# EAGLE design StdBx Proto Board w UNO(ALPHA) (EAGLE 6.6.0)
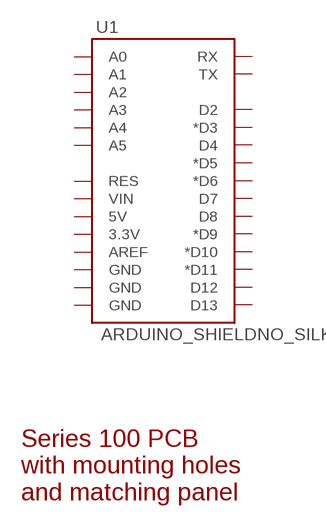
[diagram p0: schematic, sheet 1]

## Parts
U1  ARDUINO_SHIELDNO_SILK  [DUEMILANOVE_VIAS]
U$1  SERIES_100"  [SERIES_100]
Unconnected: U1.3.3V U1.5V U1.A0 U1.A1 U1.A2 U1.A3 U1.A4 U1.A5 U1.AREF U1.D2 U1.D3(*D3) U1.D4 U1.D5(*D5) U1.D6(*D6) U1.D7 U1.D8 U1.D9(*D9) U1.D10(*D10) U1.D11(*D11) U1.D12 U1.D13 U1.GND@0(GND) U1.GND@1(GND) U1.GND@2(GND) U1.RES U1.RX U1.TX U1.VIN

## Library data of the parts
U1 = SparkFun-Boards:ARDUINO_SHIELD: Arduino shield footprint
U$1 = StdBxLibrary:SERIES_100: Circuit board outline sized and with mounting that will fit the Series 100 line of StdBx enclosures. Components from the StdBx library include information that combined with this component will export a DXF file to create the end panel for the enclosure.

## Board
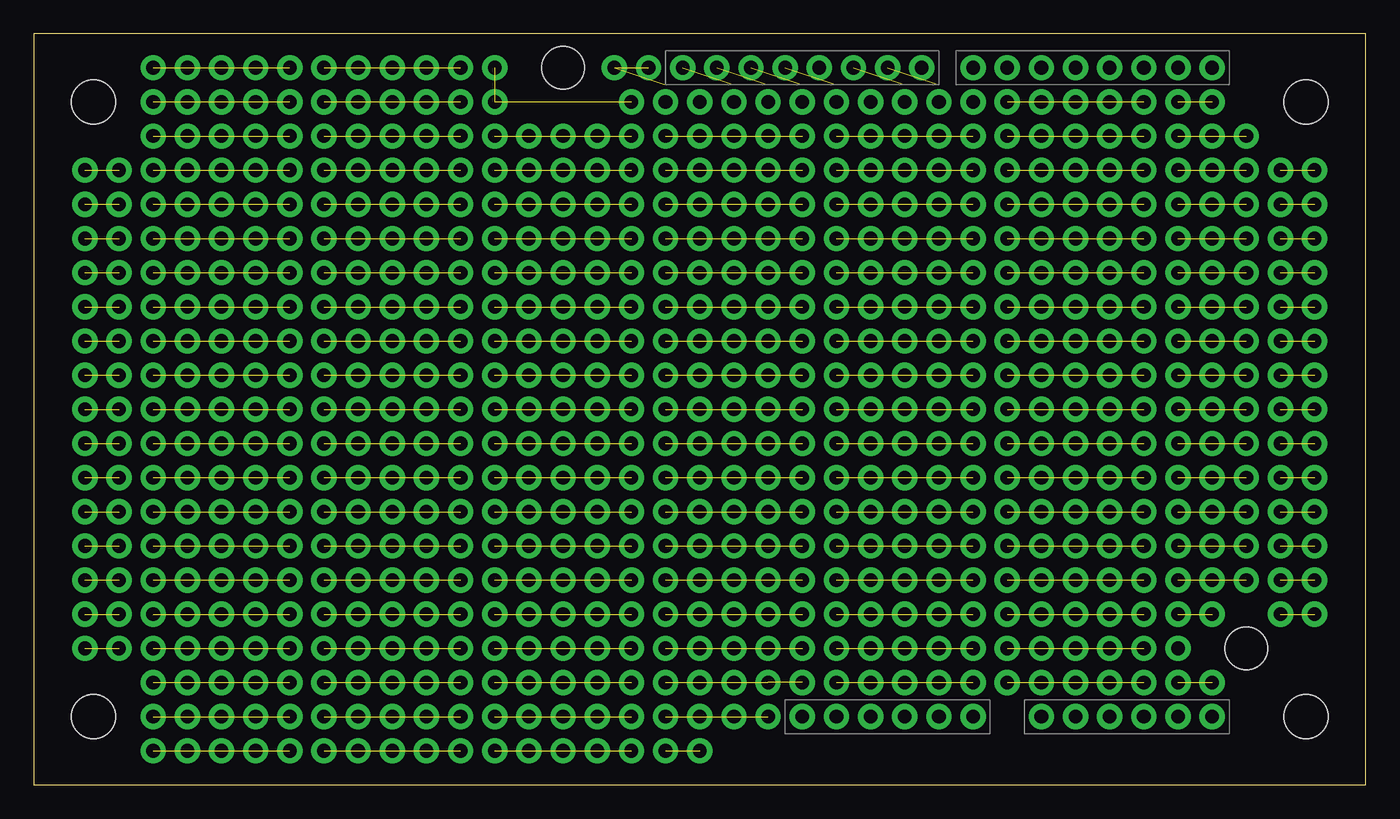
[diagram p1: board, top side]
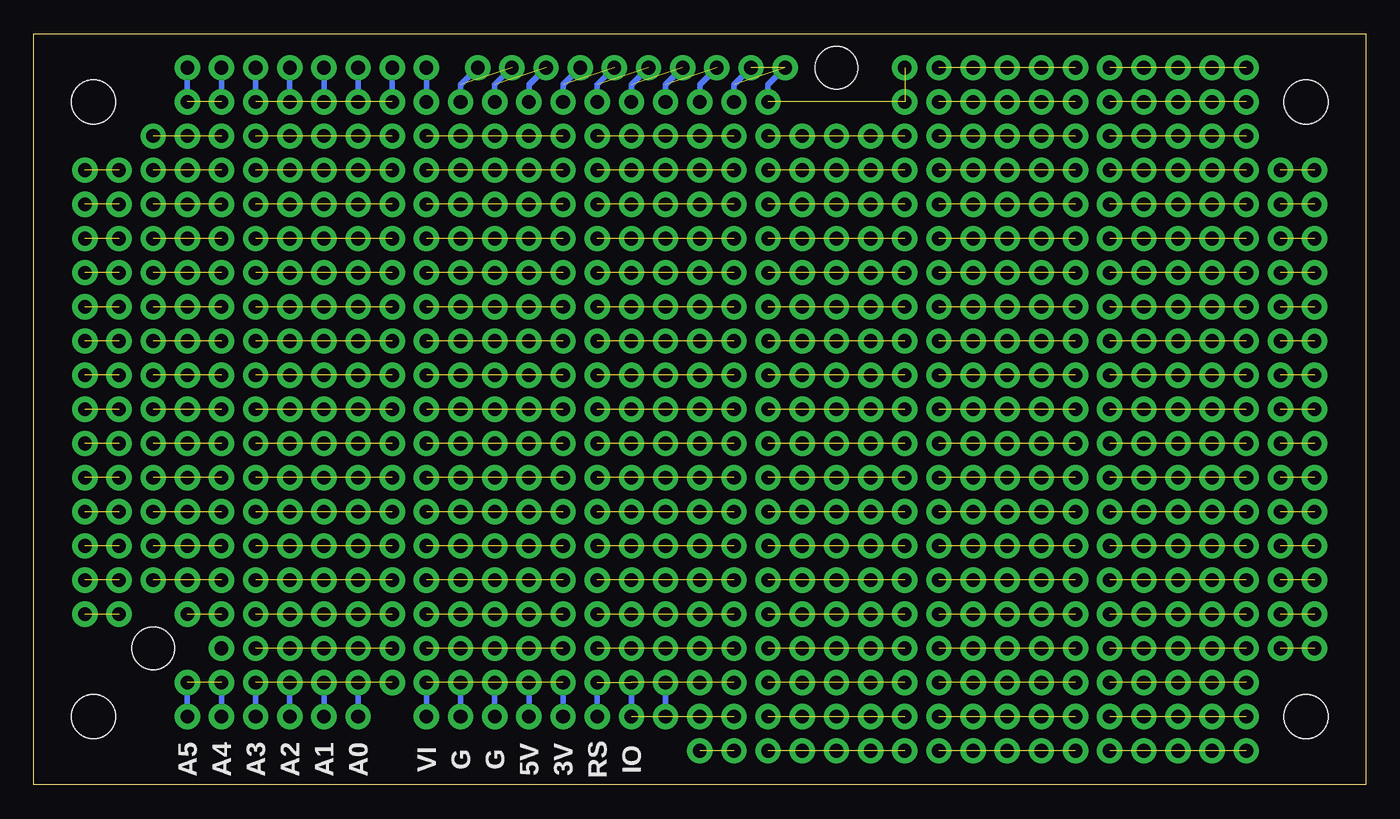
[diagram p2: board, bottom side, seen from below]

Size 99.06 x 55.88 mm. Coordinates in mm from the lower left corner, seen from the top.
Copper layers (1*16): Top 0.035mm / dielectric 1.5mm / Bottom 0.035mm
Design rules "default": minimum track width 10mil, minimum drill 24mil, track to track 8mil, track to pad 8mil, pad to pad 8mil, via to via 8mil, smd to smd 8mil, copper to edge 40mil, drill to drill 8mil, minimum pad ring 10mil, minimum via ring 8mil, stop-mask expansion 4mil, vias tented up to drill 0mil, thermal gap 10mil
Holes 3.17 mm at 39.37,53.34 90.17,10.16

### Footprints (pad centres in the part's own frame; a part is rotated, then mirrored left to right if it is on the bottom)
DUEMILANOVE_VIAS = drill 1.016 pad 1.88: 3.3V 50.8,13.97; 5V 50.8,16.51; A0 50.8,29.21; A1 50.8,31.75; A2 50.8,34.29; A3 50.8,36.83; A4 50.8,39.37; A5 50.8,41.91; AREF 2.54,2.54; D2 2.54,36.83; D3 2.54,34.29; D4 2.54,31.75; D5 2.54,29.21; D6 2.54,26.67; D7 2.54,24.13; D8 2.54,20.32; D9 2.54,17.78; D10 2.54,15.24; D11 2.54,12.7; D12 2.54,10.16; D13 2.54,7.62; GND@0 50.8,19.05; GND@1 50.8,21.59; GND@2 2.54,5.08; RES 50.8,11.43; RX 2.54,41.91; TX 2.54,39.37; VIN 50.8,24.13
SERIES_100 = hole 3.302: 4.445,50.8; 94.615,50.8; 4.445,5.08; 94.615,5.08

### Placement (x,y rotation side)
U1  45.72,55.88 270 top
U$1  0,0 0 top

### Tracks (layer width: path | path; a pad name or v marks a point on that pad's centre or on a via)
N$1  (via drill 1.02 pad 1.88)  (4 unrouted)
  other vias: 16.51,53.34 13.97,53.34 11.43,53.34 8.89,53.34 19.05,53.34
N$2  (via drill 1.02 pad 1.88)  (4 unrouted)
  other vias: 16.51,50.8 13.97,50.8 11.43,50.8 8.89,50.8 19.05,50.8
N$3  (via drill 1.02 pad 1.88)  (1 unrouted)
  other vias: 3.81,10.16 6.35,10.16
N$4  (via drill 1.02 pad 1.88)  (4 unrouted)
  other vias: 16.51,48.26 13.97,48.26 11.43,48.26 8.89,48.26 19.05,48.26
N$5  (via drill 1.02 pad 1.88)  (4 unrouted)
  other vias: 16.51,45.72 13.97,45.72 11.43,45.72 8.89,45.72 19.05,45.72
N$6  (via drill 1.02 pad 1.88)  (4 unrouted)
  other vias: 16.51,43.18 13.97,43.18 11.43,43.18 8.89,43.18 19.05,43.18
N$7  (via drill 1.02 pad 1.88)  (4 unrouted)
  other vias: 16.51,40.64 13.97,40.64 11.43,40.64 8.89,40.64 19.05,40.64
N$8  (via drill 1.02 pad 1.88)  (4 unrouted)
  other vias: 16.51,38.1 13.97,38.1 11.43,38.1 8.89,38.1 19.05,38.1
N$10  (via drill 1.02 pad 1.88)  (4 unrouted)
  other vias: 29.21,53.34 26.67,53.34 24.13,53.34 21.59,53.34 31.75,53.34
N$11  (via drill 1.02 pad 1.88)  (4 unrouted)
  other vias: 29.21,50.8 26.67,50.8 24.13,50.8 21.59,50.8 31.75,50.8
N$12  (via drill 1.02 pad 1.88)  (4 unrouted)
  other vias: 29.21,48.26 26.67,48.26 24.13,48.26 21.59,48.26 31.75,48.26
N$13  (via drill 1.02 pad 1.88)  (4 unrouted)
  other vias: 29.21,45.72 26.67,45.72 24.13,45.72 21.59,45.72 31.75,45.72
N$14  (via drill 1.02 pad 1.88)  (4 unrouted)
  other vias: 29.21,43.18 26.67,43.18 24.13,43.18 21.59,43.18 31.75,43.18
N$15  (via drill 1.02 pad 1.88)  (4 unrouted)
  other vias: 29.21,40.64 26.67,40.64 24.13,40.64 21.59,40.64 31.75,40.64
N$16  (via drill 1.02 pad 1.88)  (4 unrouted)
  other vias: 29.21,38.1 26.67,38.1 24.13,38.1 21.59,38.1 31.75,38.1
N$17  (via drill 1.02 pad 1.88)  (1 unrouted)
  other vias: 45.72,53.34 43.18,53.34
N$19  (via drill 1.02 pad 1.88)  (3 unrouted)
  Bottom 0.406: v46.99,50.8 46.99,52.07 45.72,53.34 | v44.45,50.8 44.45,52.07 43.18,53.34
  other vias: 34.29,53.34 34.29,50.8
N$20  (via drill 1.02 pad 1.88)  (4 unrouted)
  other vias: 41.91,48.26 39.37,48.26 36.83,48.26 34.29,48.26 44.45,48.26
N$21  (via drill 1.02 pad 1.88)  (4 unrouted)
  other vias: 41.91,45.72 39.37,45.72 36.83,45.72 34.29,45.72 44.45,45.72
N$22  (via drill 1.02 pad 1.88)  (4 unrouted)
  other vias: 41.91,43.18 39.37,43.18 36.83,43.18 34.29,43.18 44.45,43.18
N$23  (via drill 1.02 pad 1.88)  (4 unrouted)
  other vias: 41.91,40.64 39.37,40.64 36.83,40.64 34.29,40.64 44.45,40.64
N$24  (via drill 1.02 pad 1.88)  (4 unrouted)
  other vias: 41.91,38.1 39.37,38.1 36.83,38.1 34.29,38.1 44.45,38.1
N$25  (via drill 1.02 pad 1.88)
  Bottom 0.406: v69.85,50.8 69.85,53.34
N$27  (via drill 1.02 pad 1.88)  (4 unrouted)
  Bottom 0.406: v52.07,50.8 52.07,52.07 50.8,53.34 | v49.53,50.8 49.53,52.07 48.26,53.34 | v54.61,50.8 54.61,52.07 53.34,53.34 | v57.15,50.8 57.15,52.07 55.88,53.34 | v59.69,50.8 59.69,52.07 58.42,53.34
N$28  (via drill 1.02 pad 1.88)  (4 unrouted)
  other vias: 54.61,48.26 52.07,48.26 49.53,48.26 46.99,48.26 57.15,48.26
N$29  (via drill 1.02 pad 1.88)  (4 unrouted)
  other vias: 54.61,45.72 52.07,45.72 49.53,45.72 46.99,45.72 57.15,45.72
N$30  (via drill 1.02 pad 1.88)  (4 unrouted)
  other vias: 54.61,43.18 52.07,43.18 49.53,43.18 46.99,43.18 57.15,43.18
N$31  (via drill 1.02 pad 1.88)  (4 unrouted)
  other vias: 54.61,40.64 52.07,40.64 49.53,40.64 46.99,40.64 57.15,40.64
N$32  (via drill 1.02 pad 1.88)  (4 unrouted)
  other vias: 54.61,38.1 52.07,38.1 49.53,38.1 46.99,38.1 57.15,38.1
N$33  (via drill 1.02 pad 1.88)  (4 unrouted)
  other vias: 16.51,35.56 13.97,35.56 11.43,35.56 8.89,35.56 19.05,35.56
N$34  (via drill 1.02 pad 1.88)  (4 unrouted)
  other vias: 16.51,33.02 13.97,33.02 11.43,33.02 8.89,33.02 19.05,33.02
N$35  (via drill 1.02 pad 1.88)  (4 unrouted)
  other vias: 16.51,30.48 13.97,30.48 11.43,30.48 8.89,30.48 19.05,30.48
N$36  (via drill 1.02 pad 1.88)  (4 unrouted)
  other vias: 16.51,27.94 13.97,27.94 11.43,27.94 8.89,27.94 19.05,27.94
N$37  (via drill 1.02 pad 1.88)  (4 unrouted)
  other vias: 16.51,25.4 13.97,25.4 11.43,25.4 8.89,25.4 19.05,25.4
N$38  (via drill 1.02 pad 1.88)  (4 unrouted)
  other vias: 16.51,22.86 13.97,22.86 11.43,22.86 8.89,22.86 19.05,22.86
N$39  (via drill 1.02 pad 1.88)  (4 unrouted)
  other vias: 16.51,20.32 13.97,20.32 11.43,20.32 8.89,20.32 19.05,20.32
N$40  (via drill 1.02 pad 1.88)  (4 unrouted)
  other vias: 16.51,17.78 13.97,17.78 11.43,17.78 8.89,17.78 19.05,17.78
N$41  (via drill 1.02 pad 1.88)  (4 unrouted)
  other vias: 29.21,35.56 26.67,35.56 24.13,35.56 21.59,35.56 31.75,35.56
N$42  (via drill 1.02 pad 1.88)  (4 unrouted)
  other vias: 29.21,33.02 26.67,33.02 24.13,33.02 21.59,33.02 31.75,33.02
N$43  (via drill 1.02 pad 1.88)  (4 unrouted)
  other vias: 29.21,30.48 26.67,30.48 24.13,30.48 21.59,30.48 31.75,30.48
N$44  (via drill 1.02 pad 1.88)  (4 unrouted)
  other vias: 29.21,27.94 26.67,27.94 24.13,27.94 21.59,27.94 31.75,27.94
N$45  (via drill 1.02 pad 1.88)  (4 unrouted)
  other vias: 29.21,25.4 26.67,25.4 24.13,25.4 21.59,25.4 31.75,25.4
N$46  (via drill 1.02 pad 1.88)  (4 unrouted)
  other vias: 29.21,22.86 26.67,22.86 24.13,22.86 21.59,22.86 31.75,22.86
N$47  (via drill 1.02 pad 1.88)  (4 unrouted)
  other vias: 29.21,20.32 26.67,20.32 24.13,20.32 21.59,20.32 31.75,20.32
N$48  (via drill 1.02 pad 1.88)  (4 unrouted)
  other vias: 29.21,17.78 26.67,17.78 24.13,17.78 21.59,17.78 31.75,17.78
N$49  (via drill 1.02 pad 1.88)  (4 unrouted)
  other vias: 41.91,35.56 39.37,35.56 36.83,35.56 34.29,35.56 44.45,35.56
N$50  (via drill 1.02 pad 1.88)  (4 unrouted)
  other vias: 41.91,33.02 39.37,33.02 36.83,33.02 34.29,33.02 44.45,33.02
N$51  (via drill 1.02 pad 1.88)  (4 unrouted)
  other vias: 41.91,30.48 39.37,30.48 36.83,30.48 34.29,30.48 44.45,30.48
N$52  (via drill 1.02 pad 1.88)  (4 unrouted)
  other vias: 41.91,27.94 39.37,27.94 36.83,27.94 34.29,27.94 44.45,27.94
N$53  (via drill 1.02 pad 1.88)  (4 unrouted)
  other vias: 41.91,25.4 39.37,25.4 36.83,25.4 34.29,25.4 44.45,25.4
N$54  (via drill 1.02 pad 1.88)  (4 unrouted)
  other vias: 41.91,22.86 39.37,22.86 36.83,22.86 34.29,22.86 44.45,22.86
N$55  (via drill 1.02 pad 1.88)  (4 unrouted)
  other vias: 41.91,20.32 39.37,20.32 36.83,20.32 34.29,20.32 44.45,20.32
N$56  (via drill 1.02 pad 1.88)  (4 unrouted)
  other vias: 41.91,17.78 39.37,17.78 36.83,17.78 34.29,17.78 44.45,17.78
N$57  (via drill 1.02 pad 1.88)  (4 unrouted)
  other vias: 54.61,35.56 52.07,35.56 49.53,35.56 46.99,35.56 57.15,35.56
N$58  (via drill 1.02 pad 1.88)  (4 unrouted)
  other vias: 54.61,33.02 52.07,33.02 49.53,33.02 46.99,33.02 57.15,33.02
N$59  (via drill 1.02 pad 1.88)  (4 unrouted)
  other vias: 54.61,30.48 52.07,30.48 49.53,30.48 46.99,30.48 57.15,30.48
N$60  (via drill 1.02 pad 1.88)  (4 unrouted)
  other vias: 54.61,27.94 52.07,27.94 49.53,27.94 46.99,27.94 57.15,27.94
N$61  (via drill 1.02 pad 1.88)  (4 unrouted)
  other vias: 54.61,25.4 52.07,25.4 49.53,25.4 46.99,25.4 57.15,25.4
N$62  (via drill 1.02 pad 1.88)  (4 unrouted)
  other vias: 54.61,22.86 52.07,22.86 49.53,22.86 46.99,22.86 57.15,22.86
N$63  (via drill 1.02 pad 1.88)  (4 unrouted)
  other vias: 54.61,20.32 52.07,20.32 49.53,20.32 46.99,20.32 57.15,20.32
N$64  (via drill 1.02 pad 1.88)  (4 unrouted)
  other vias: 54.61,17.78 52.07,17.78 49.53,17.78 46.99,17.78 57.15,17.78
N$65  (via drill 1.02 pad 1.88)  (4 unrouted)
  other vias: 16.51,15.24 13.97,15.24 11.43,15.24 8.89,15.24 19.05,15.24
N$66  (via drill 1.02 pad 1.88)  (4 unrouted)
  other vias: 16.51,12.7 13.97,12.7 11.43,12.7 8.89,12.7 19.05,12.7
N$67  (via drill 1.02 pad 1.88)  (4 unrouted)
  other vias: 16.51,10.16 13.97,10.16 11.43,10.16 8.89,10.16 19.05,10.16
N$68  (via drill 1.02 pad 1.88)  (4 unrouted)
  other vias: 16.51,7.62 13.97,7.62 11.43,7.62 8.89,7.62 19.05,7.62
N$69  (via drill 1.02 pad 1.88)  (4 unrouted)
  other vias: 16.51,5.08 13.97,5.08 11.43,5.08 8.89,5.08 19.05,5.08
N$70  (via drill 1.02 pad 1.88)  (4 unrouted)
  other vias: 29.21,15.24 26.67,15.24 24.13,15.24 21.59,15.24 31.75,15.24
N$71  (via drill 1.02 pad 1.88)  (4 unrouted)
  other vias: 29.21,12.7 26.67,12.7 24.13,12.7 21.59,12.7 31.75,12.7
N$72  (via drill 1.02 pad 1.88)  (4 unrouted)
  other vias: 29.21,10.16 26.67,10.16 24.13,10.16 21.59,10.16 31.75,10.16
N$73  (via drill 1.02 pad 1.88)  (4 unrouted)
  other vias: 29.21,7.62 26.67,7.62 24.13,7.62 21.59,7.62 31.75,7.62
N$74  (via drill 1.02 pad 1.88)  (4 unrouted)
  other vias: 29.21,5.08 26.67,5.08 24.13,5.08 21.59,5.08 31.75,5.08
N$75  (via drill 1.02 pad 1.88)  (4 unrouted)
  other vias: 41.91,15.24 39.37,15.24 36.83,15.24 34.29,15.24 44.45,15.24
N$76  (via drill 1.02 pad 1.88)  (4 unrouted)
  other vias: 41.91,12.7 39.37,12.7 36.83,12.7 34.29,12.7 44.45,12.7
N$77  (via drill 1.02 pad 1.88)  (4 unrouted)
  other vias: 41.91,10.16 39.37,10.16 36.83,10.16 34.29,10.16 44.45,10.16
N$78  (via drill 1.02 pad 1.88)  (4 unrouted)
  other vias: 41.91,7.62 39.37,7.62 36.83,7.62 34.29,7.62 44.45,7.62
N$79  (via drill 1.02 pad 1.88)  (4 unrouted)
  other vias: 41.91,5.08 39.37,5.08 36.83,5.08 34.29,5.08 44.45,5.08
N$80  (via drill 1.02 pad 1.88)  (4 unrouted)
  other vias: 54.61,15.24 52.07,15.24 49.53,15.24 46.99,15.24 57.15,15.24
N$81  (via drill 1.02 pad 1.88)  (4 unrouted)
  other vias: 54.61,12.7 52.07,12.7 49.53,12.7 46.99,12.7 57.15,12.7
N$82  (via drill 1.02 pad 1.88)  (4 unrouted)
  other vias: 54.61,10.16 52.07,10.16 49.53,10.16 46.99,10.16 57.15,10.16
N$83  (via drill 1.02 pad 1.88)  (4 unrouted)
  Bottom 0.406: v57.15,7.62 57.15,5.08
  other vias: 54.61,7.62 52.07,7.62 49.53,7.62 46.99,7.62
N$84  (via drill 1.02 pad 1.88)  (3 unrouted)
  Bottom 0.406: v54.61,5.08 54.61,7.62 | v52.07,5.08 52.07,7.62
  other vias: 49.53,5.08 46.99,5.08
N$85  (via drill 1.02 pad 1.88)  (4 unrouted)
  other vias: 16.51,2.54 13.97,2.54 11.43,2.54 8.89,2.54 19.05,2.54
N$86  (via drill 1.02 pad 1.88)  (4 unrouted)
  other vias: 29.21,2.54 26.67,2.54 24.13,2.54 21.59,2.54 31.75,2.54
N$87  (via drill 1.02 pad 1.88)  (4 unrouted)
  other vias: 41.91,2.54 39.37,2.54 36.83,2.54 34.29,2.54 44.45,2.54
N$88  (via drill 1.02 pad 1.88)  (1 unrouted)
  other vias: 49.53,2.54 46.99,2.54
N$91  (via drill 1.02 pad 1.88)  (2 unrouted)
  Bottom 0.406: v62.23,50.8 62.23,52.07 60.96,53.34 | v64.77,50.8 64.77,52.07 63.5,53.34 | v67.31,50.8 67.31,52.07 66.04,53.34
N$92  (via drill 1.02 pad 1.88)  (4 unrouted)
  other vias: 67.31,48.26 64.77,48.26 62.23,48.26 59.69,48.26 69.85,48.26
N$93  (via drill 1.02 pad 1.88)  (4 unrouted)
  other vias: 67.31,45.72 64.77,45.72 62.23,45.72 59.69,45.72 69.85,45.72
N$94  (via drill 1.02 pad 1.88)  (4 unrouted)
  other vias: 67.31,43.18 64.77,43.18 62.23,43.18 59.69,43.18 69.85,43.18
N$95  (via drill 1.02 pad 1.88)  (4 unrouted)
  other vias: 67.31,40.64 64.77,40.64 62.23,40.64 59.69,40.64 69.85,40.64
N$96  (via drill 1.02 pad 1.88)  (4 unrouted)
  other vias: 67.31,38.1 64.77,38.1 62.23,38.1 59.69,38.1 69.85,38.1
N$99  (via drill 1.02 pad 1.88)  (4 unrouted)
  Bottom 0.406: v72.39,50.8 72.39,53.34 | v74.93,50.8 74.93,53.34 | v77.47,50.8 77.47,53.34 | v80.01,50.8 80.01,53.34 | v82.55,50.8 82.55,53.34
N$100  (via drill 1.02 pad 1.88)  (4 unrouted)
  other vias: 80.01,48.26 77.47,48.26 74.93,48.26 72.39,48.26 82.55,48.26
N$101  (via drill 1.02 pad 1.88)  (4 unrouted)
  other vias: 80.01,45.72 77.47,45.72 74.93,45.72 72.39,45.72 82.55,45.72
N$102  (via drill 1.02 pad 1.88)  (4 unrouted)
  other vias: 80.01,43.18 77.47,43.18 74.93,43.18 72.39,43.18 82.55,43.18
N$103  (via drill 1.02 pad 1.88)  (4 unrouted)
  other vias: 80.01,40.64 77.47,40.64 74.93,40.64 72.39,40.64 82.55,40.64
N$104  (via drill 1.02 pad 1.88)  (4 unrouted)
  other vias: 80.01,38.1 77.47,38.1 74.93,38.1 72.39,38.1 82.55,38.1
N$105  (via drill 1.02 pad 1.88)  (4 unrouted)
  other vias: 67.31,35.56 64.77,35.56 62.23,35.56 59.69,35.56 69.85,35.56
N$106  (via drill 1.02 pad 1.88)  (4 unrouted)
  other vias: 67.31,33.02 64.77,33.02 62.23,33.02 59.69,33.02 69.85,33.02
N$107  (via drill 1.02 pad 1.88)  (4 unrouted)
  other vias: 67.31,30.48 64.77,30.48 62.23,30.48 59.69,30.48 69.85,30.48
N$108  (via drill 1.02 pad 1.88)  (4 unrouted)
  other vias: 67.31,27.94 64.77,27.94 62.23,27.94 59.69,27.94 69.85,27.94
N$109  (via drill 1.02 pad 1.88)  (4 unrouted)
  other vias: 67.31,25.4 64.77,25.4 62.23,25.4 59.69,25.4 69.85,25.4
N$110  (via drill 1.02 pad 1.88)  (4 unrouted)
  other vias: 67.31,22.86 64.77,22.86 62.23,22.86 59.69,22.86 69.85,22.86
N$111  (via drill 1.02 pad 1.88)  (4 unrouted)
  other vias: 67.31,20.32 64.77,20.32 62.23,20.32 59.69,20.32 69.85,20.32
N$112  (via drill 1.02 pad 1.88)  (4 unrouted)
  other vias: 67.31,17.78 64.77,17.78 62.23,17.78 59.69,17.78 69.85,17.78
N$113  (via drill 1.02 pad 1.88)  (4 unrouted)
  other vias: 80.01,35.56 77.47,35.56 74.93,35.56 72.39,35.56 82.55,35.56
N$114  (via drill 1.02 pad 1.88)  (4 unrouted)
  other vias: 80.01,33.02 77.47,33.02 74.93,33.02 72.39,33.02 82.55,33.02
N$115  (via drill 1.02 pad 1.88)  (4 unrouted)
  other vias: 80.01,30.48 77.47,30.48 74.93,30.48 72.39,30.48 82.55,30.48
N$116  (via drill 1.02 pad 1.88)  (4 unrouted)
  other vias: 80.01,27.94 77.47,27.94 74.93,27.94 72.39,27.94 82.55,27.94
N$117  (via drill 1.02 pad 1.88)  (4 unrouted)
  other vias: 80.01,25.4 77.47,25.4 74.93,25.4 72.39,25.4 82.55,25.4
N$118  (via drill 1.02 pad 1.88)  (4 unrouted)
  other vias: 80.01,22.86 77.47,22.86 74.93,22.86 72.39,22.86 82.55,22.86
N$119  (via drill 1.02 pad 1.88)  (4 unrouted)
  other vias: 80.01,20.32 77.47,20.32 74.93,20.32 72.39,20.32 82.55,20.32
N$120  (via drill 1.02 pad 1.88)  (4 unrouted)
  other vias: 80.01,17.78 77.47,17.78 74.93,17.78 72.39,17.78 82.55,17.78
N$121  (via drill 1.02 pad 1.88)  (4 unrouted)
  other vias: 67.31,15.24 64.77,15.24 62.23,15.24 59.69,15.24 69.85,15.24
N$122  (via drill 1.02 pad 1.88)  (4 unrouted)
  other vias: 67.31,12.7 64.77,12.7 62.23,12.7 59.69,12.7 69.85,12.7
N$123  (via drill 1.02 pad 1.88)  (4 unrouted)
  other vias: 67.31,10.16 64.77,10.16 62.23,10.16 59.69,10.16 69.85,10.16
N$124  (via drill 1.02 pad 1.88)  (4 unrouted)
  Bottom 0.406: v59.69,7.62 59.69,5.08 | v62.23,7.62 62.23,5.08 | v64.77,7.62 64.77,5.08 | v67.31,7.62 67.31,5.08 | v69.85,7.62 69.85,5.08
N$126  (via drill 1.02 pad 1.88)  (4 unrouted)
  other vias: 80.01,15.24 77.47,15.24 74.93,15.24 72.39,15.24 82.55,15.24
N$127  (via drill 1.02 pad 1.88)  (4 unrouted)
  other vias: 80.01,12.7 77.47,12.7 74.93,12.7 72.39,12.7 82.55,12.7
N$128  (via drill 1.02 pad 1.88)  (4 unrouted)
  other vias: 80.01,10.16 77.47,10.16 74.93,10.16 72.39,10.16 82.55,10.16
N$129  (via drill 1.02 pad 1.88)  (4 unrouted)
  Bottom 0.406: v74.93,7.62 74.93,5.08 | v77.47,7.62 77.47,5.08 | v80.01,7.62 80.01,5.08 | v82.55,7.62 82.55,5.08
  other vias: 72.39,7.62
N$135  (via drill 1.02 pad 1.88)  (1 unrouted)
  Bottom 0.406: v85.09,50.8 85.09,53.34 | v87.63,50.8 87.63,53.34
N$136  (via drill 1.02 pad 1.88)  (2 unrouted)
  other vias: 87.63,48.26 85.09,48.26 90.17,48.26
N$137  (via drill 1.02 pad 1.88)  (2 unrouted)
  other vias: 87.63,45.72 85.09,45.72 90.17,45.72
N$138  (via drill 1.02 pad 1.88)  (2 unrouted)
  other vias: 87.63,43.18 85.09,43.18 90.17,43.18
N$139  (via drill 1.02 pad 1.88)  (2 unrouted)
  other vias: 87.63,40.64 85.09,40.64 90.17,40.64
N$140  (via drill 1.02 pad 1.88)  (2 unrouted)
  other vias: 87.63,38.1 85.09,38.1 90.17,38.1
N$141  (via drill 1.02 pad 1.88)  (2 unrouted)
  other vias: 87.63,35.56 85.09,35.56 90.17,35.56
N$142  (via drill 1.02 pad 1.88)  (2 unrouted)
  other vias: 87.63,33.02 85.09,33.02 90.17,33.02
N$143  (via drill 1.02 pad 1.88)  (2 unrouted)
  other vias: 87.63,30.48 85.09,30.48 90.17,30.48
N$144  (via drill 1.02 pad 1.88)  (2 unrouted)
  other vias: 87.63,27.94 85.09,27.94 90.17,27.94
N$145  (via drill 1.02 pad 1.88)  (2 unrouted)
  other vias: 87.63,25.4 85.09,25.4 90.17,25.4
N$146  (via drill 1.02 pad 1.88)  (2 unrouted)
  other vias: 87.63,22.86 85.09,22.86 90.17,22.86
N$147  (via drill 1.02 pad 1.88)  (2 unrouted)
  other vias: 87.63,20.32 85.09,20.32 90.17,20.32
N$148  (via drill 1.02 pad 1.88)  (2 unrouted)
  other vias: 87.63,17.78 85.09,17.78 90.17,17.78
N$149  (via drill 1.02 pad 1.88)  (2 unrouted)
  other vias: 87.63,15.24 85.09,15.24 90.17,15.24
N$150  (via drill 1.02 pad 1.88)  (1 unrouted)
  other vias: 87.63,12.7 85.09,12.7
N$151  (via drill 1.02 pad 1.88)
  other vias: 85.09,10.16
N$152  (via drill 1.02 pad 1.88)  (1 unrouted)
  Bottom 0.406: v85.09,7.62 85.09,5.08 | v87.63,7.62 87.63,5.08
N$155  (via drill 1.02 pad 1.88)  (1 unrouted)
  other vias: 92.71,45.72 95.25,45.72
N$156  (via drill 1.02 pad 1.88)  (1 unrouted)
  other vias: 92.71,43.18 95.25,43.18
N$157  (via drill 1.02 pad 1.88)  (1 unrouted)
  other vias: 92.71,40.64 95.25,40.64
N$158  (via drill 1.02 pad 1.88)  (1 unrouted)
  other vias: 92.71,38.1 95.25,38.1
N$159  (via drill 1.02 pad 1.88)  (1 unrouted)
  other vias: 92.71,35.56 95.25,35.56
N$160  (via drill 1.02 pad 1.88)  (1 unrouted)
  other vias: 92.71,33.02 95.25,33.02
N$161  (via drill 1.02 pad 1.88)  (1 unrouted)
  other vias: 92.71,30.48 95.25,30.48
N$162  (via drill 1.02 pad 1.88)  (1 unrouted)
  other vias: 92.71,27.94 95.25,27.94
N$163  (via drill 1.02 pad 1.88)  (1 unrouted)
  other vias: 92.71,25.4 95.25,25.4
N$164  (via drill 1.02 pad 1.88)  (1 unrouted)
  other vias: 92.71,22.86 95.25,22.86
N$165  (via drill 1.02 pad 1.88)  (1 unrouted)
  other vias: 92.71,20.32 95.25,20.32
N$166  (via drill 1.02 pad 1.88)  (1 unrouted)
  other vias: 92.71,17.78 95.25,17.78
N$167  (via drill 1.02 pad 1.88)  (1 unrouted)
  other vias: 92.71,15.24 95.25,15.24
N$168  (via drill 1.02 pad 1.88)  (1 unrouted)
  other vias: 92.71,12.7 95.25,12.7
N$169  (via drill 1.02 pad 1.88)  (1 unrouted)
  other vias: 3.81,45.72 6.35,45.72
N$170  (via drill 1.02 pad 1.88)  (1 unrouted)
  other vias: 3.81,43.18 6.35,43.18
N$171  (via drill 1.02 pad 1.88)  (1 unrouted)
  other vias: 3.81,40.64 6.35,40.64
N$172  (via drill 1.02 pad 1.88)  (1 unrouted)
  other vias: 3.81,38.1 6.35,38.1
N$173  (via drill 1.02 pad 1.88)  (1 unrouted)
  other vias: 3.81,35.56 6.35,35.56
N$174  (via drill 1.02 pad 1.88)  (1 unrouted)
  other vias: 3.81,33.02 6.35,33.02
N$175  (via drill 1.02 pad 1.88)  (1 unrouted)
  other vias: 3.81,30.48 6.35,30.48
N$176  (via drill 1.02 pad 1.88)  (1 unrouted)
  other vias: 3.81,27.94 6.35,27.94
N$177  (via drill 1.02 pad 1.88)  (1 unrouted)
  other vias: 3.81,25.4 6.35,25.4
N$178  (via drill 1.02 pad 1.88)  (1 unrouted)
  other vias: 3.81,22.86 6.35,22.86
N$179  (via drill 1.02 pad 1.88)  (1 unrouted)
  other vias: 3.81,20.32 6.35,20.32
N$180  (via drill 1.02 pad 1.88)  (1 unrouted)
  other vias: 3.81,17.78 6.35,17.78
N$181  (via drill 1.02 pad 1.88)  (1 unrouted)
  other vias: 3.81,15.24 6.35,15.24
N$182  (via drill 1.02 pad 1.88)  (1 unrouted)
  other vias: 3.81,12.7 6.35,12.7

### Text on the board
bPlace: IO | RS | 3V | 5V | G | G | VI | A0 | A1 | A2 | A3 | A4 | A5